# EAGLE design Dazzle_v1 (EAGLE 9.2.1)

## Sheet 1 of 3
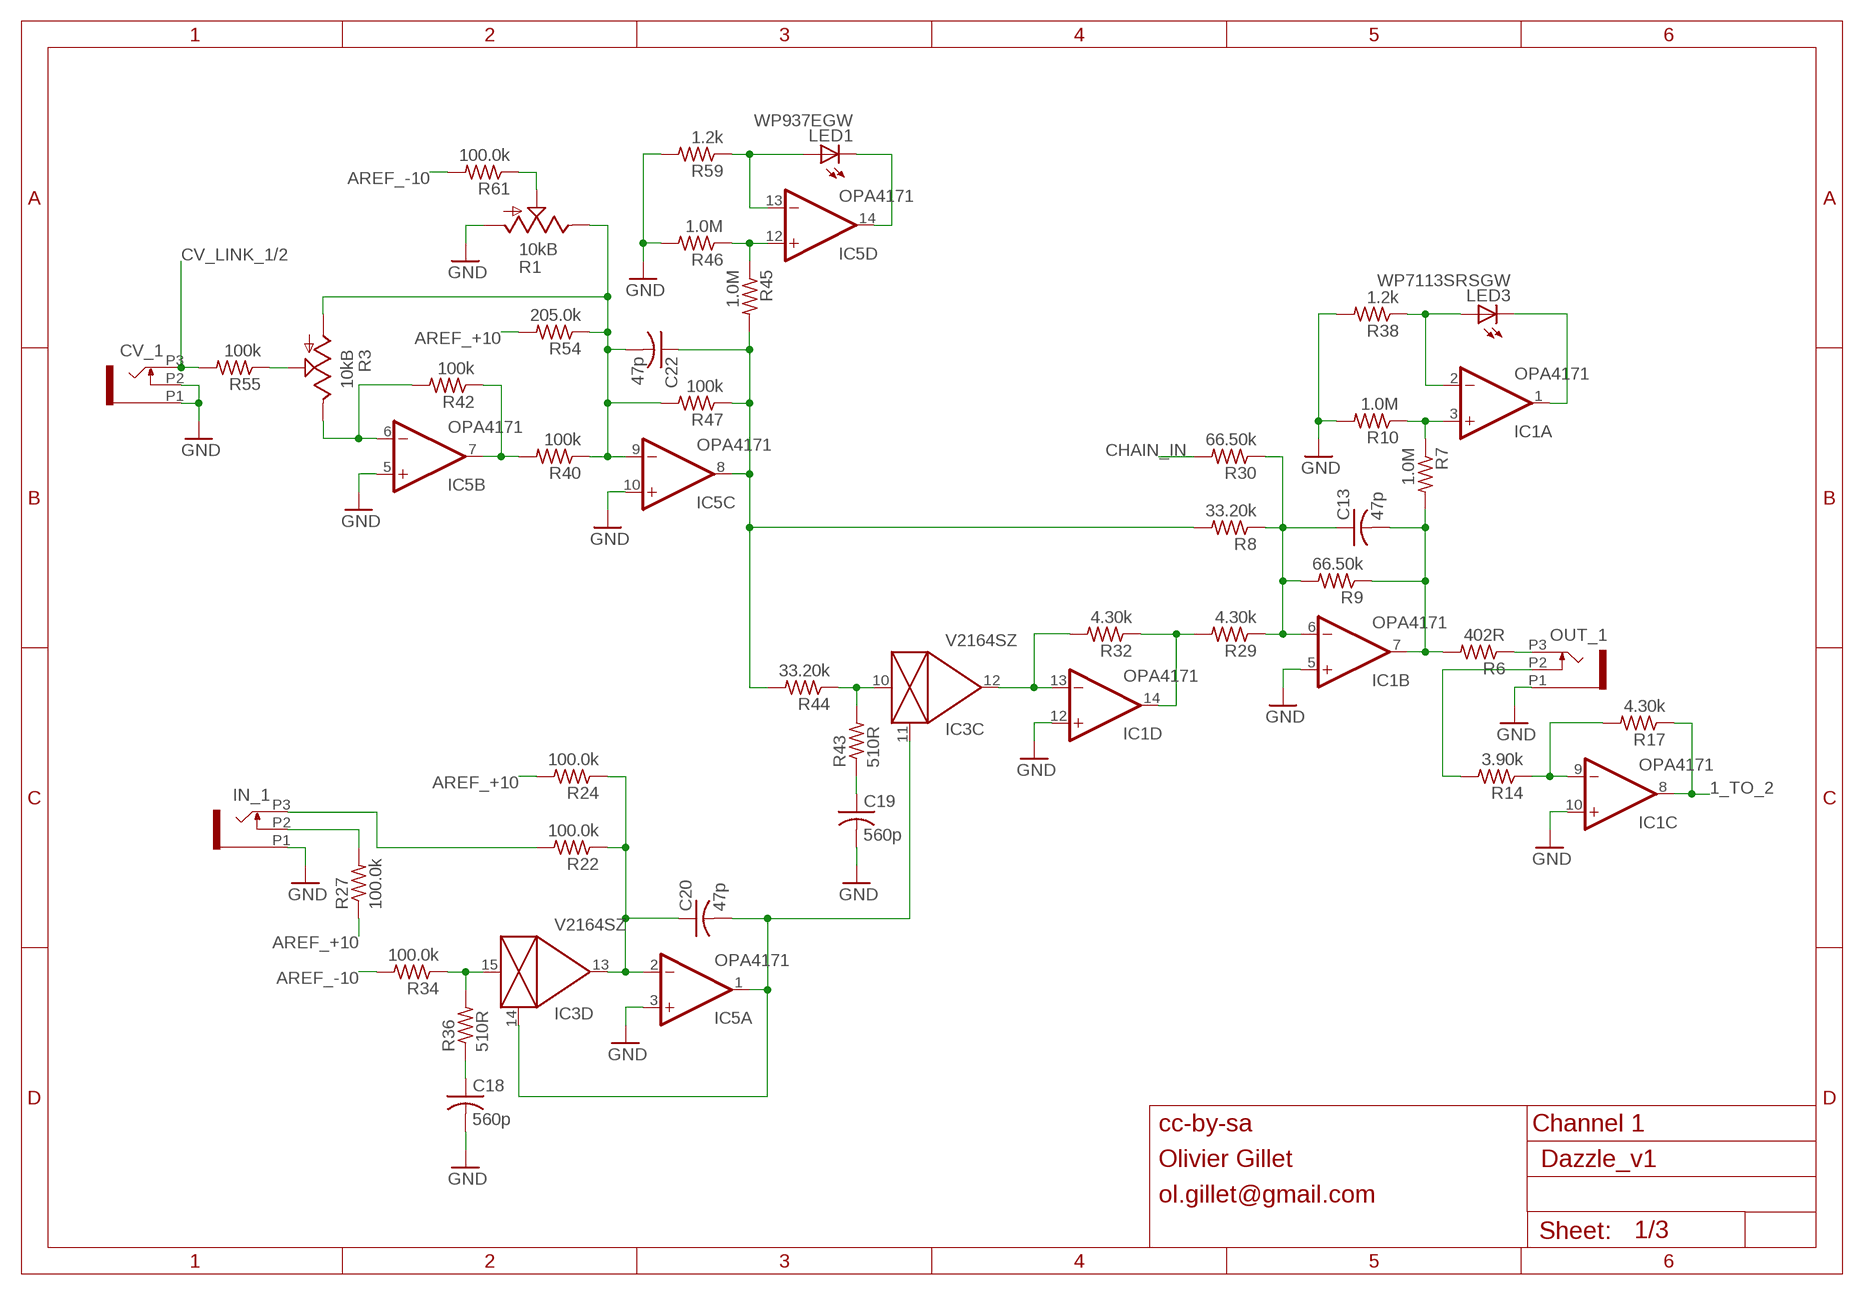
[diagram p0: schematic, sheet 1]

### Parts
C13  47p  C-USC0603  [C0603]
C18  560p  C-USC0603  [C0603]
C19  560p  C-USC0603  [C0603]
C20  47p  C-USC0603  [C0603]
C22  47p  C-USC0603  [C0603]
CV_1  OG-PJ301_PJ301_THONKICONN  [OG-PJ301_WQP_PJ_301M6_NO_HOLE]
IC1  OPA4171  TL074PW  [TSSOP14]
IC3  V2164SZ  SSM2164S  [SOIC16N]
IC5  OPA4171  TL074PW  [TSSOP14]
IN_1  OG-PJ301_PJ301_THONKICONN  [OG-PJ301_WQP_PJ_301M6_NO_HOLE]
LED1  WP937EGW  LED3MM  [LED3MM]
LED3  WP7113SRSGW  LED5MM  [LED5MM]
OUT_1  OG-PJ301_PJ301_THONKICONN  [OG-PJ301_WQP_PJ_301M6_NO_HOLE]
R1  10kB  POT_USVERTICAL_PS  [ALPS_POT_VERTICAL_PS]
R3  10kB  POT-ALPS_POT_USVERTICAL_PS  [POT-ALPS_ALPS_POT_VERTICAL_PS]
R6  402R  R-US_R0603  [R0603]
R7  1.0M  R-US_R0603  [R0603]
R8  33.20k  R-US_R0603  [R0603]
R9  66.50k  R-US_R0603  [R0603]
R10  1.0M  R-US_R0603  [R0603]
R14  3.90k  R-US_R0603  [R0603]
R17  4.30k  R-US_R0603  [R0603]
R22  100.0k  R-US_R0603  [R0603]
R24  100.0k  R-US_R0603  [R0603]
R27  100.0k  R-US_R0603  [R0603]
R29  4.30k  R-US_R0603  [R0603]
R30  66.50k  R-US_R0603  [R0603]
R32  4.30k  R-US_R0603  [R0603]
R34  100.0k  R-US_R0603  [R0603]
R36  510R  R-US_R0603  [R0603]
R38  1.2k  R-US_R0603  [R0603]
R40  100k  R-US_R0603  [R0603]
R42  100k  R-US_R0603  [R0603]
R43  510R  R-US_R0603  [R0603]
R44  33.20k  R-US_R0603  [R0603]
R45  1.0M  R-US_R0603  [R0603]
R46  1.0M  R-US_R0603  [R0603]
R47  100k  R-US_R0603  [R0603]
R54  205.0k  R-US_R0603  [R0603]
R55  100k  R-US_R0603  [R0603]
R59  1.2k  R-US_R0603  [R0603]
R61  100.0k  R-US_R0603  [R0603]

### Nets
1_TO_2: IC1.8(C:OUT) R17.1 ; also sheet 2
AREF_+10: R24.2 R27.1 R54.2 ; also sheet 2,3
AREF_-10: R34.2 R61.2 ; also sheet 2,3
CHAIN_IN: R30.2 ; also sheet 2
CV_LINK_1/2: CV_1.P3 R55.2 ; also sheet 2
FOO: IC3.15(D:IN) R34.1 R36.2
GAIN_1: C22.1 IC5.8(C:OUT) R8.2 R44.2 R45.2 R47.1
GND: C18.2 C19.2 CV_1.P1 CV_1.P2 IC1.5(B:+IN) IC1.10(C:+IN) IC1.12(D:+IN) IC5.3(A:+IN) IC5.5(B:+IN) IC5.10(C:+IN) IN_1.P1 OUT_1.P1 R1.P$3(A) R10.2 R38.2 R46.2 R59.2 ; also sheet 2,3
N$2: R1.P$2(S) R61.1
N$3: IC1.13(D:-IN) IC3.12(C:OUT) R32.2
N$4: IC5.14(D:OUT) LED1.K(C)
N$5: IC5.6(B:-IN) R3.P$1(E) R42.2
N$7: OUT_1.P3 R6.1
N$8: IC5.7(B:OUT) R40.2 R42.1
N$9: C22.2 IC5.9(C:-IN) R1.P$1(E) R3.P$3(A) R40.1 R47.2 R54.1
N$10: C13.1 IC1.6(B:-IN) R8.1 R9.2 R29.1 R30.1
N$14: R3.P$2(S) R55.1
N$15: IC5.13(D:-IN) LED1.A R59.1
N$18: IC1.1(A:OUT) LED3.K(C)
N$19: IC1.2(A:-IN) LED3.A R38.1
N$20: C18.1 R36.1
N$21: IN_1.P3 R22.2
N$22: IC1.9(C:-IN) R14.1 R17.2
N$25: OUT_1.P2 R14.2
N$47: C19.1 R43.1
N$54: IN_1.P2 R27.2
N$64: IC1.14(D:OUT) R29.2 R32.1
N$65: C20.1 IC3.13(D:OUT) IC5.2(A:-IN) R22.1 R24.1
N$66: C20.2 IC3.11(C:CTRL) IC3.14(D:CTRL) IC5.1(A:OUT)
N$75: IC3.10(C:IN) R43.2 R44.1
N$96: IC1.3(A:+IN) R7.1 R10.1
N$99: IC5.12(D:+IN) R45.1 R46.1
OUT1: C13.2 IC1.7(B:OUT) R6.2 R7.2 R9.1

### Notes on the sheet
- cc-by-sa | Channel 1
- Olivier Gillet
- ol.gillet@gmail.com

## Sheet 2 of 3
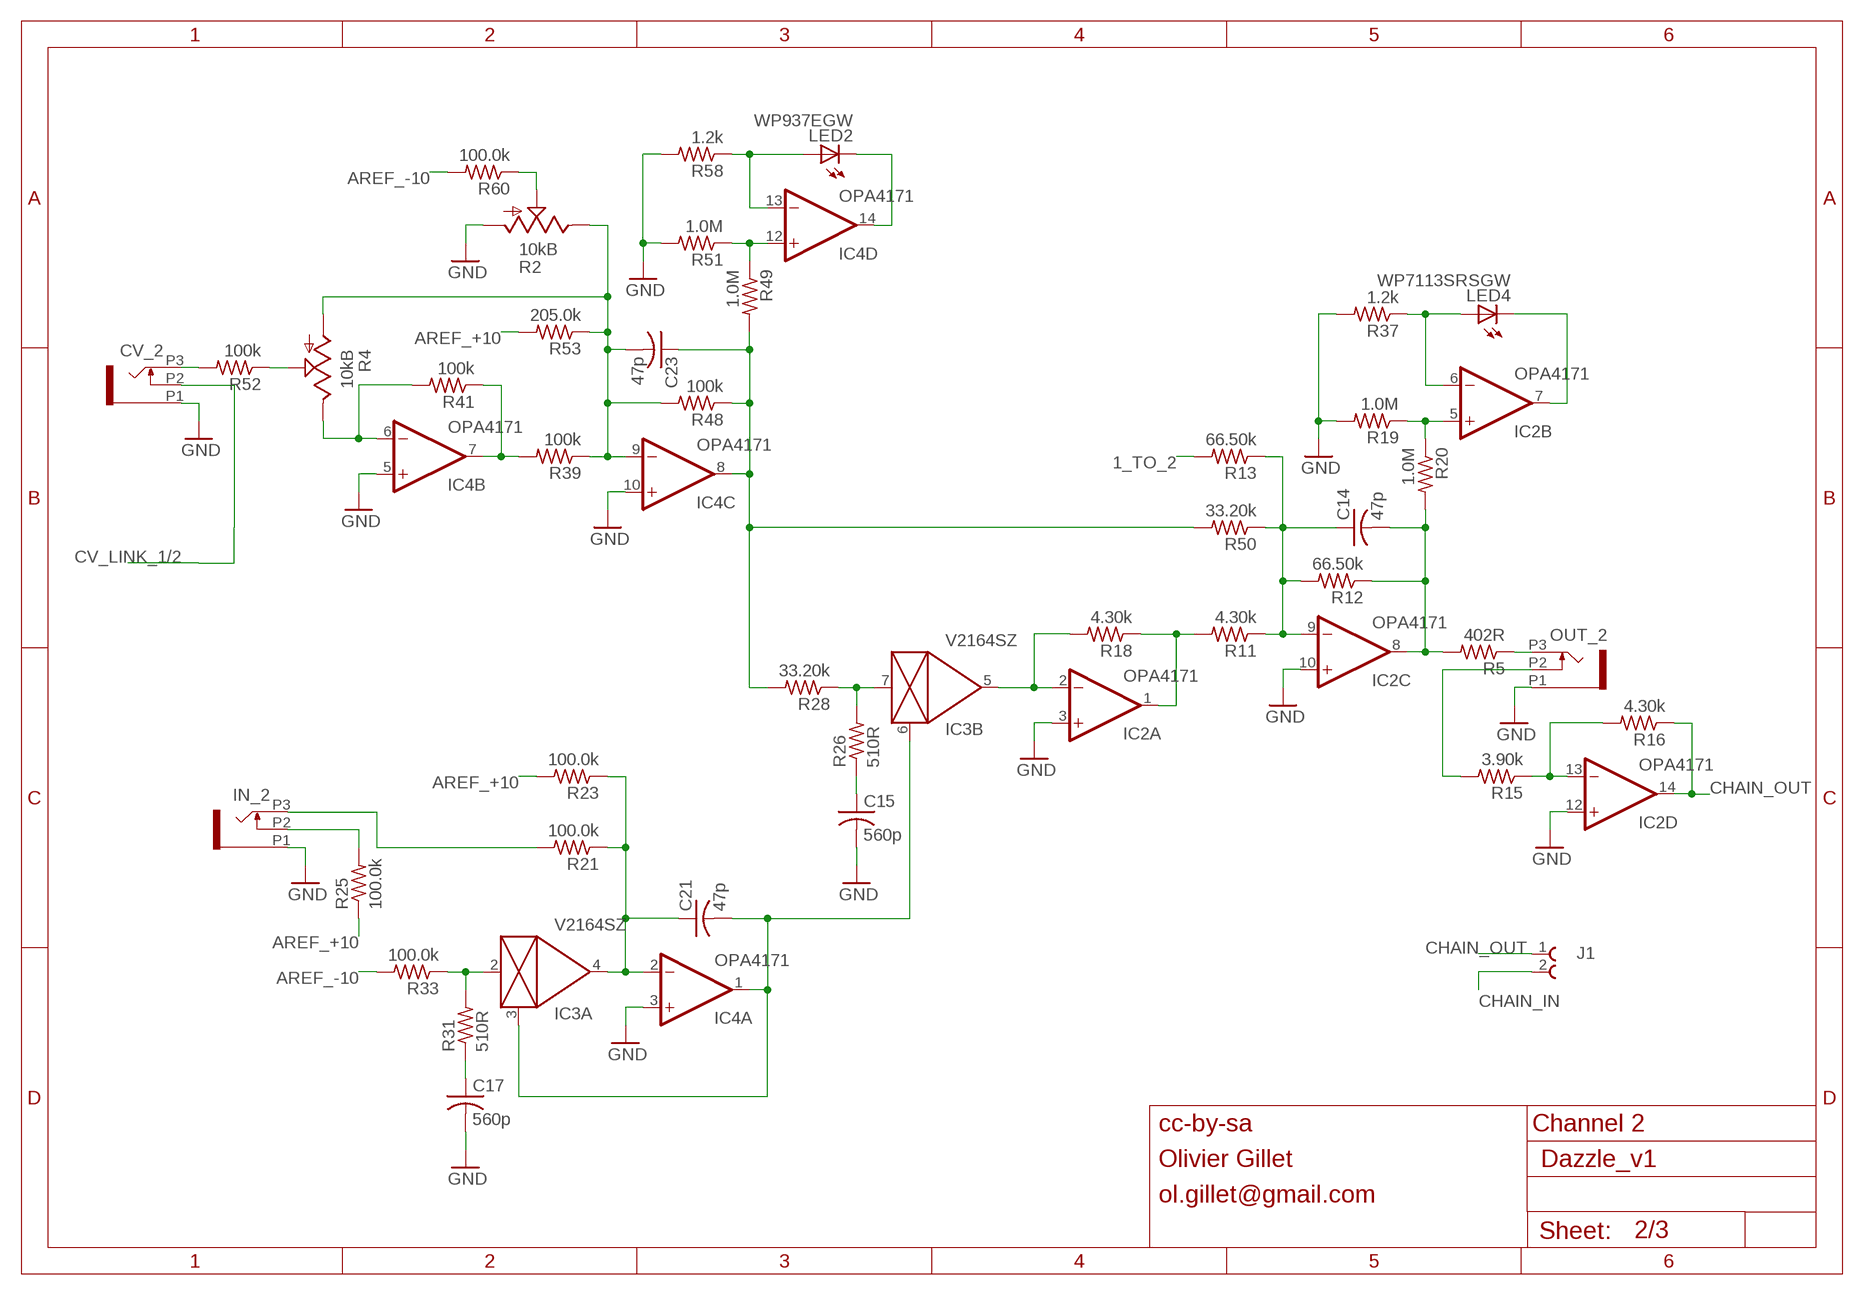
[diagram p1: schematic, sheet 2]

### Parts
C14  47p  C-USC0603  [C0603]
C15  560p  C-USC0603  [C0603]
C17  560p  C-USC0603  [C0603]
C21  47p  C-USC0603  [C0603]
C23  47p  C-USC0603  [C0603]
CV_2  OG-PJ301_PJ301_THONKICONN  [OG-PJ301_WQP_PJ_301M6_NO_HOLE]
IC2  OPA4171  TL074PW  [TSSOP14]
IC4  OPA4171  TL074PW  [TSSOP14]
IN_2  OG-PJ301_PJ301_THONKICONN  [OG-PJ301_WQP_PJ_301M6_NO_HOLE]
J1  61300211121  [61300211121]
LED2  WP937EGW  LED3MM  [LED3MM]
LED4  WP7113SRSGW  LED5MM  [LED5MM]
OUT_2  OG-PJ301_PJ301_THONKICONN  [OG-PJ301_WQP_PJ_301M6_NO_HOLE]
R2  10kB  POT_USVERTICAL_PS  [ALPS_POT_VERTICAL_PS]
R4  10kB  POT-ALPS_POT_USVERTICAL_PS  [POT-ALPS_ALPS_POT_VERTICAL_PS]
R5  402R  R-US_R0603  [R0603]
R11  4.30k  R-US_R0603  [R0603]
R12  66.50k  R-US_R0603  [R0603]
R13  66.50k  R-US_R0603  [R0603]
R15  3.90k  R-US_R0603  [R0603]
R16  4.30k  R-US_R0603  [R0603]
R18  4.30k  R-US_R0603  [R0603]
R19  1.0M  R-US_R0603  [R0603]
R20  1.0M  R-US_R0603  [R0603]
R21  100.0k  R-US_R0603  [R0603]
R23  100.0k  R-US_R0603  [R0603]
R25  100.0k  R-US_R0603  [R0603]
R26  510R  R-US_R0603  [R0603]
R28  33.20k  R-US_R0603  [R0603]
R31  510R  R-US_R0603  [R0603]
R33  100.0k  R-US_R0603  [R0603]
R37  1.2k  R-US_R0603  [R0603]
R39  100k  R-US_R0603  [R0603]
R41  100k  R-US_R0603  [R0603]
R48  100k  R-US_R0603  [R0603]
R49  1.0M  R-US_R0603  [R0603]
R50  33.20k  R-US_R0603  [R0603]
R51  1.0M  R-US_R0603  [R0603]
R52  100k  R-US_R0603  [R0603]
R53  205.0k  R-US_R0603  [R0603]
R58  1.2k  R-US_R0603  [R0603]
R60  100.0k  R-US_R0603  [R0603]

### Nets
1_TO_2: R13.2 ; also sheet 1
AREF_+10: R23.2 R25.1 R53.2 ; also sheet 1,3
AREF_-10: R33.2 R60.2 ; also sheet 1,3
CHAIN_IN: J1.2 ; also sheet 1
CHAIN_OUT: IC2.14(D:OUT) J1.1 R16.1
CV_LINK_1/2: CV_2.P2 ; also sheet 1
FOO1: IC3.2(A:IN) R31.2 R33.1
GAIN_2: C23.1 IC4.8(C:OUT) R28.2 R48.1 R49.2 R50.2
GND: C15.2 C17.2 CV_2.P1 IC2.3(A:+IN) IC2.10(C:+IN) IC2.12(D:+IN) IC4.3(A:+IN) IC4.5(B:+IN) IC4.10(C:+IN) IN_2.P1 OUT_2.P1 R2.P$3(A) R19.2 R37.2 R51.2 R58.2 ; also sheet 1,3
N$6: OUT_2.P3 R5.1
N$17: C15.1 R26.1
N$24: IC3.7(B:IN) R26.2 R28.1
N$26: IC2.2(A:-IN) IC3.5(B:OUT) R18.2
N$27: C14.1 IC2.9(C:-IN) R11.1 R12.2 R13.1 R50.1
N$28: CV_2.P3 R52.2
N$29: IC4.6(B:-IN) R4.P$1(E) R41.2
N$30: IC4.7(B:OUT) R39.2 R41.1
N$31: C23.2 IC4.9(C:-IN) R2.P$1(E) R4.P$3(A) R39.1 R48.2 R53.1
N$32: R2.P$2(S) R60.1
N$33: IC4.14(D:OUT) LED2.K(C)
N$34: IC4.13(D:-IN) LED2.A R58.1
N$35: IC2.7(B:OUT) LED4.K(C)
N$36: IC2.6(B:-IN) LED4.A R37.1
N$37: IC2.13(D:-IN) R15.1 R16.2
N$38: OUT_2.P2 R15.2
N$39: IC2.1(A:OUT) R11.2 R18.1
N$40: R4.P$2(S) R52.1
N$41: C17.1 R31.1
N$42: C21.1 IC3.4(A:OUT) IC4.2(A:-IN) R21.1 R23.1
N$43: C21.2 IC3.3(A:CTRL) IC3.6(B:CTRL) IC4.1(A:OUT)
N$44: IN_2.P3 R21.2
N$87: IN_2.P2 R25.2
N$97: IC2.5(B:+IN) R19.1 R20.1
N$103: IC4.12(D:+IN) R49.1 R51.1
OUT2: C14.2 IC2.8(C:OUT) R5.2 R12.1 R20.2

### Notes on the sheet
- cc-by-sa | Channel 2
- Olivier Gillet
- ol.gillet@gmail.com

## Sheet 3 of 3
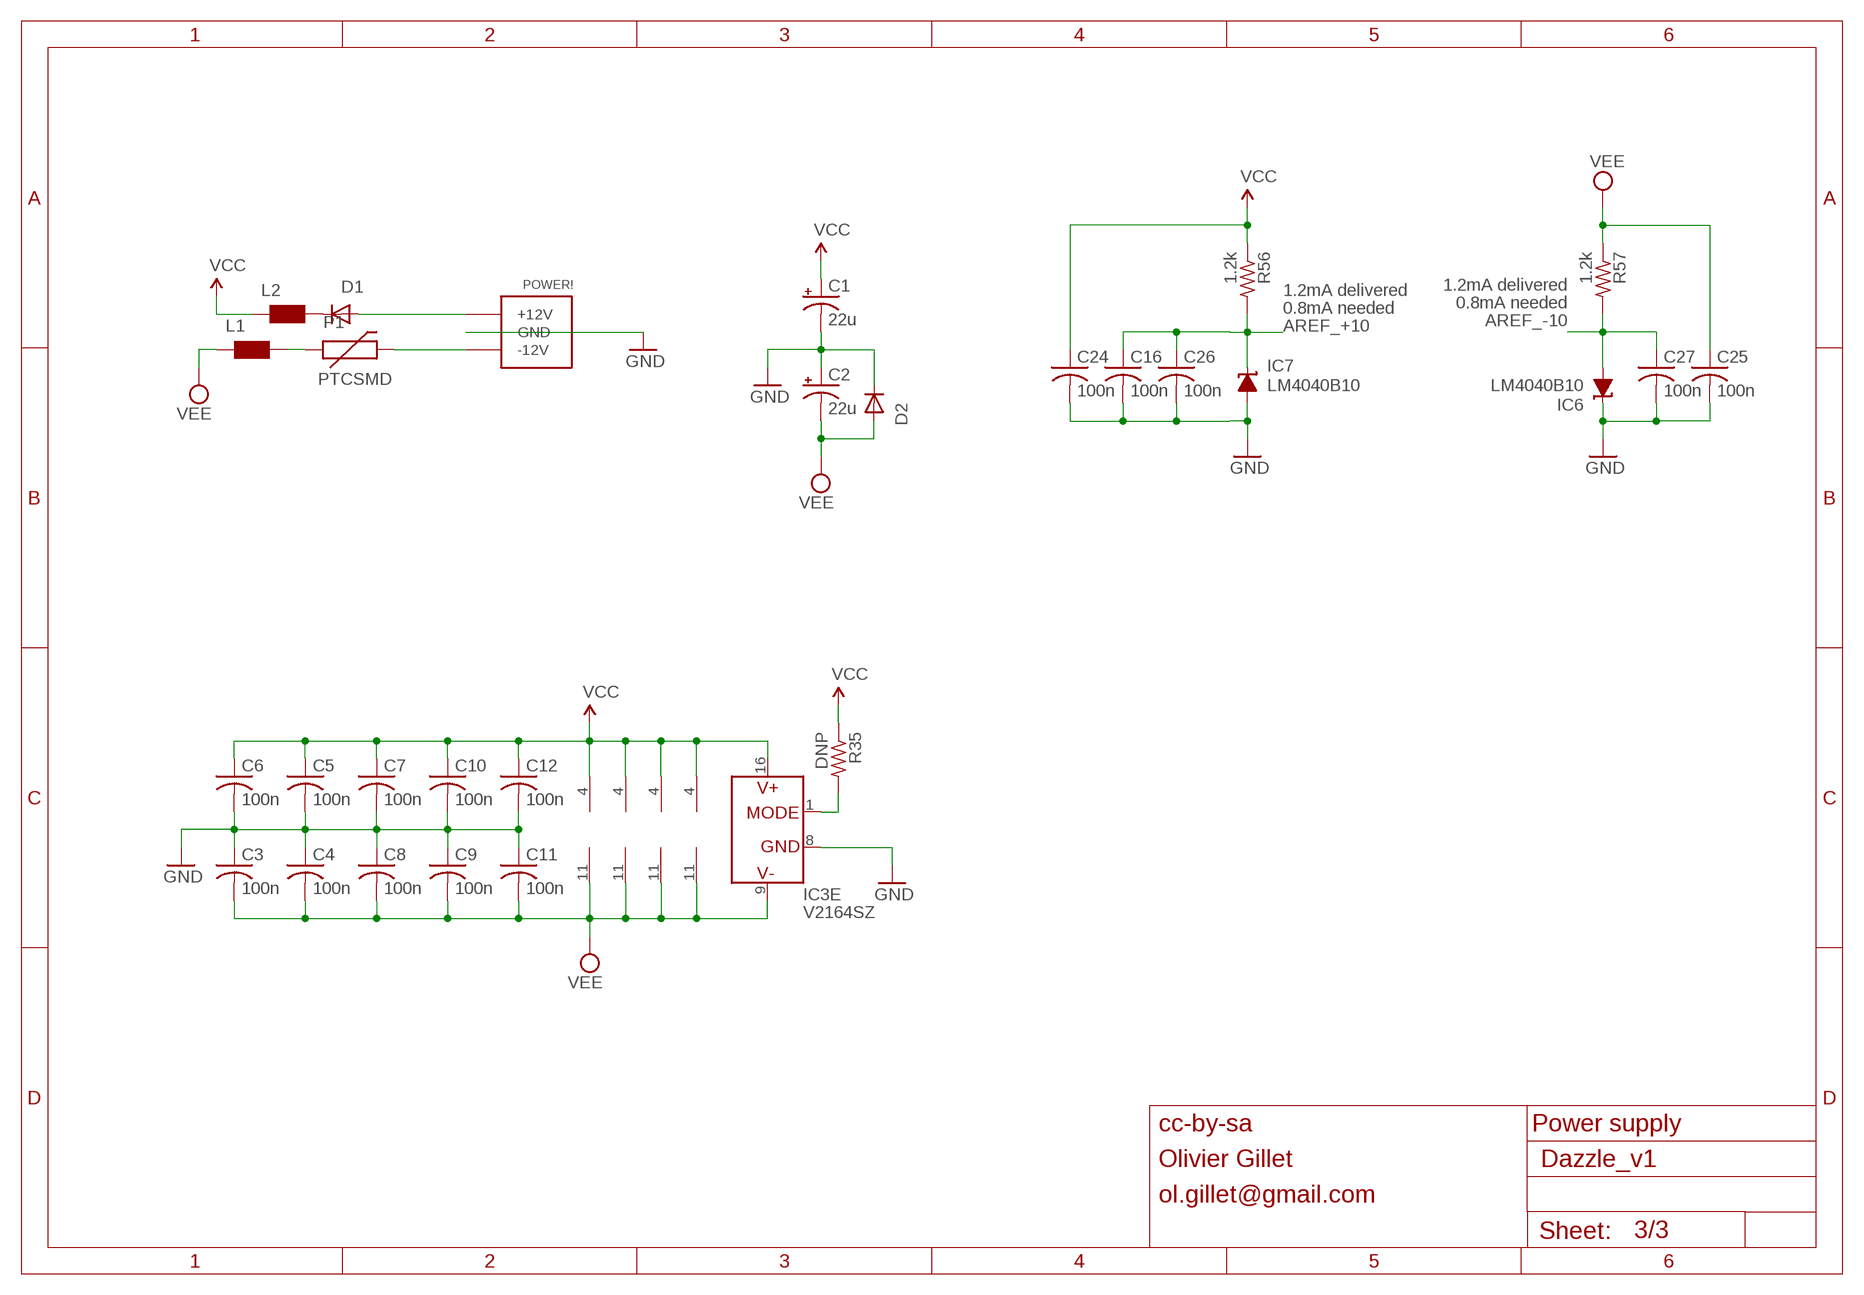
[diagram p2: schematic, sheet 3]

### Parts
C1  22u  CPOL-USC  [PANASONIC_C]
C2  22u  CPOL-USC  [PANASONIC_C]
C3  100n  C-USC0603  [C0603]
C4  100n  C-USC0603  [C0603]
C5  100n  C-USC0603  [C0603]
C6  100n  C-USC0603  [C0603]
C7  100n  C-USC0603  [C0603]
C8  100n  C-USC0603  [C0603]
C9  100n  C-USC0603  [C0603]
C10  100n  C-USC0603  [C0603]
C11  100n  C-USC0603  [C0603]
C12  100n  C-USC0603  [C0603]
C16  100n  C-USC0603  [C0603]
C24  100n  C-USC0603  [C0603]
C25  100n  C-USC0603  [C0603]
C26  100n  C-USC0603  [C0603]
C27  100n  C-USC0603  [C0603]
D1  1N5819HW  DIODE-SOD123  [SOD123]
D2  1N5819HW  DIODE-SOD123  [SOD123]
IC6  LM4040B10  LM4041B12DBZ  [DBZ_R-PDSO-G3]
IC7  LM4040B10  LM4041B12DBZ  [DBZ_R-PDSO-G3]
L1  WE-CBF_0603  [0603]
L2  WE-CBF_0603  [0603]
P1  PTCSMD  [PTC-1206]
POWER!  POWER_SIMPLE  [2X05_SMT_HEADER]
R35  DNP  R-US_R0603  [R0603]
R56  1.2k  R-US_R0603  [R0603]
R57  1.2k  R-US_R0603  [R0603]

### Nets
AREF_+10: C16.1 C26.1 IC7.1(C) R56.2 ; also sheet 1,2
AREF_-10: C27.1 IC6.2(A) R57.2 ; also sheet 1,2
GND: C1.- C2.+ C3.1 C4.1 C5.2 C6.2 C7.2 C8.1 C9.1 C10.2 C11.1 C12.2 C16.2 C24.2 C25.2 C26.2 C27.2 D2.C IC3.8(E:GND) IC6.1(C) IC7.2(A) POWER!.3(GND) POWER!.4(GND) POWER!.5(GND) POWER!.6(GND) POWER!.7(GND) POWER!.8(GND) ; also sheet 1,2
N$1: IC3.1(E:MODE) R35.2
N$11: D1.A POWER!.9(+12V) POWER!.10(+12V)
N$12: P1.2 POWER!.1(-12V) POWER!.2(-12V)
N$13: L1.2 P1.1
N$16: D1.C L2.2
VCC: C1.+ C5.1 C6.1 C7.1 C10.1 C12.1 C24.1 IC1.4(P:V+) IC2.4(P:V+) IC3.16(E:V+) IC4.4(P:V+) IC5.4(P:V+) L2.1 R35.1 R56.1
VEE: C2.- C3.2 C4.2 C8.2 C9.2 C11.2 C25.1 D2.A IC1.11(P:V-) IC2.11(P:V-) IC3.9(E:V-) IC4.11(P:V-) IC5.11(P:V-) L1.1 R57.1

### Notes on the sheet
- 1.2mA delivered
- 1.2mA delivered | 0.8mA needed
- 0.8mA needed
- cc-by-sa | Power supply
- Olivier Gillet
- ol.gillet@gmail.com

## Library data of the parts
C1 C2 = rcl:CPOL-US: POLARIZED CAPACITOR, American symbol
C3-C27 = rcl:C-US: CAPACITOR, American symbol
CV_1 CV_2 IN_1 IN_2 OUT_1 OUT_2 = SHAY_THONKICONNS:OG-PJ301_PJ301_THONKICONN
D1 D2 = diode:DIODE-: DIODE
IC1 IC2 IC4 IC5 = linear:TL074: OP AMP
IC3 = ssm2164:SSM2164
IC6 IC7 = texas:LM4041: PRECISION MICROPOWER SHUNT VOLTAGE REFERENCE Source: http://focus.ti.com/lit/ds/slcs146e/slcs146e.pdf
J1 = Wurth_Elektronik_Electromechanic_Board_to_Board_Connectors_rev17a:61300211121: WR-PHD 2.54mm Pin Header, 2 Pin=>Code : Con_BTB_PHD_2.54_1_THT_61300211121 <http://katalog.we-online.de/media/images/eican/Con_BTB_PHD_2.54_1_THT_6130xx11121_pf2.jpg> Details see: http://katalog.we-online.de/en/em/613_0xx_111_21 Created 2014-05-29, Karrer Zheng 2014 (C) Würth Elektronik
L1 L2 = wuerth-elektronik:WE-CBF: SMD EMI Suppression Ferrite Beads - excellent anti-EMI properties - low DCR - impedances till 3000 ohms - rated current up to 6 A
LED1-LED4 = led:LED: LED OSRAM: - CHIPLED LG R971, LG N971, LY N971, LG Q971, LY Q971, LO R971, LY R971 LH N974, LH R974 LS Q976, LO Q976, LY Q976 LO Q996 - Hyper CHIPLED LW Q18S LB Q993, LB Q99A, LB R99A - SideLED LS A670, LO A670, LY A670, LG A670, LP A670 LB A673, LV A673, LT A673, LW A673 LH A674 LY A675 LS A676, LA A676, LO A676, LY A676, LW A676 LS A679, LY A679, LG A679 - Hyper Micro SIDELED® LS Y876, LA Y876, LO Y876, LY Y876 LT Y87S - SmartLED LW L88C, LW L88S LB L89C, LB L89S, LG L890 LS L89K, LO L89K, LY L89K LS L896, LA L896, LO L896, LY L896 - TOPLED LS T670, LO T670, LY T670, LG T670, LP T670 LSG T670, LSP T670, LSY T670, LOP T670, LYG T670 LG T671, LOG T671, LSG T671 LB T673, LV T673, LT T673, LW T673 LH T674 LS T676, LA T676, LO T676, LY T676, LB T676, LH T676, LSB T676, LW T676 LB T67C, LV T67C, LT T67C, LS T67K, LO T67K, LY T67K, LW E67C LS E67B, LA E67B, LO E67B, LY E67B, LB E67C, LV E67C, LT E67C LW T67C LS T679, LY T679, LG T679 LS T770, LO T770, LY T770, LG T770, LP T770 LB T773, LV T773, LT T773, LW T773 LH T774 LS E675, LA E675, LY E675, LS T675 LS T776, LA T776, LO T776, LY T776, LB T776 LHGB T686 LT T68C, LB T68C - Hyper Mini TOPLED® LB M676 - Mini TOPLED Santana® LG M470 LS M47K, LO M47K, LY M47K Source: http://www.osram.convergy.de LUXEON: - LUMILED® LXK2-PW12-R00, LXK2-PW12-S00, LXK2-PW14-U00, LXK2-PW14-V00 LXK2-PM12-R00, LXK2-PM12-S00, LXK2-PM14-U00 LXK2-PE12-Q00, LXK2-PE12-R00, LXK2-PE12-S00, LXK2-PE14-T00, LXK2-PE14-U00 LXK2-PB12-K00, LXK2-PB12-L00, LXK2-PB12-M00, LXK2-PB14-N00, LXK2-PB14-P00, LXK2-PB14-Q00 LXK2-PR12-L00, LXK2-PR12-M00, LXK2-PR14-Q00, LXK2-PR14-R00 LXK2-PD12-Q00, LXK2-PD12-R00, LXK2-PD12-S00 LXK2-PH12-R00, LXK2-PH12-S00 LXK2-PL12-P00, LXK2-PL12-Q00, LXK2-PL12-R00 Source: www.luxeon.com KINGBRIGHT: KA-3528ASYC Source: www.kingbright.com
P1 = SparkFun:PTC: Resettable Fuse PTC Resettable Fuse. Spark Fun Electronics SKU : COM-08357
POWER! = EurorackModularParts:POWER_SIMPLE
R1 R2 = pot-alps:POT_US
R3 R4 = braids_v50:POT-ALPS_POT_US
R5-R61 = rcl:R-US_: RESISTOR, American symbol

## Board
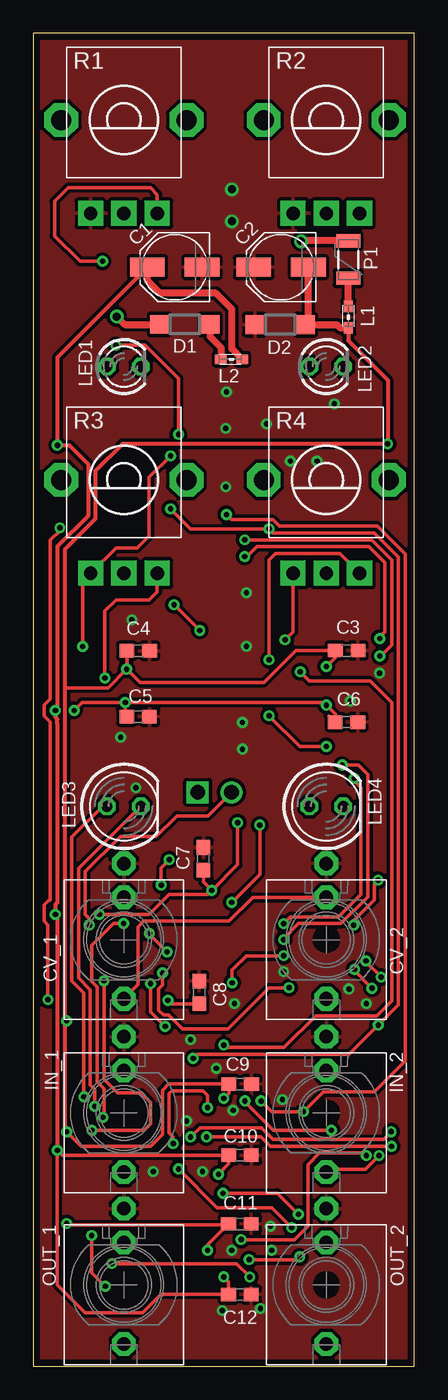
[diagram p3: board, top side]
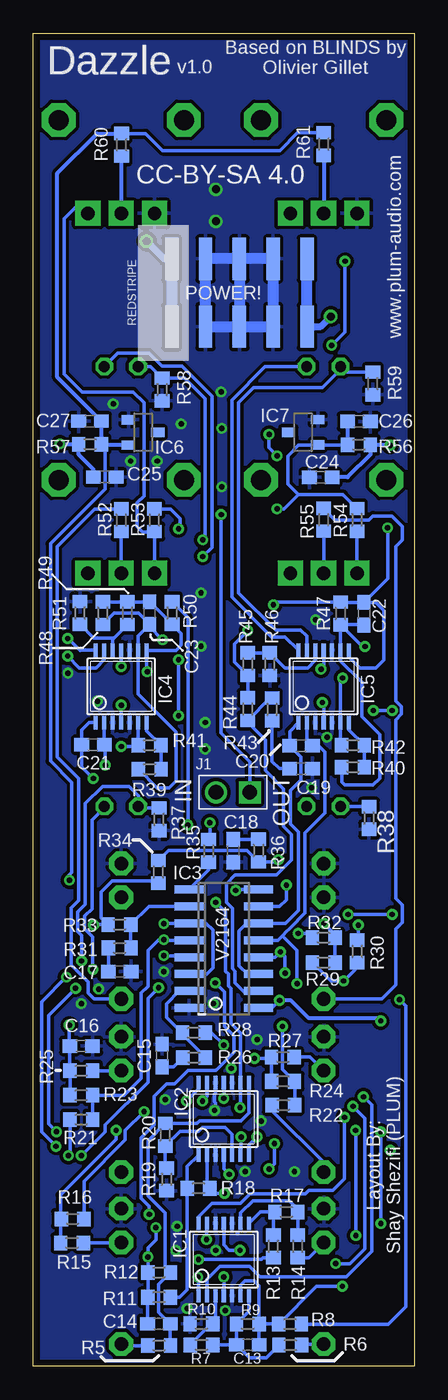
[diagram p4: board, bottom side, seen from below]

Size 28.6 x 100 mm. Coordinates in mm from the lower left corner, seen from the top.
Outline: 0,0 28.6,0 28.6,100 0,100 0,0
Copper layers (1*16): Top 0.035mm / dielectric 1.5mm / Bottom 0.035mm
Design rules "default *": minimum track width 6mil, minimum drill 0.4mm, track to track 10mil, track to pad 6mil, pad to pad 6mil, via to via 6mil, smd to smd 6mil, copper to edge 20mil, drill to drill 6mil, minimum pad ring 10mil, minimum via ring 8mil, stop-mask expansion 4mil, vias tented up to drill 25mil, thermal gap 10mil

### Footprints (pad centres in the part's own frame; a part is rotated, then mirrored left to right if it is on the bottom)
PANASONIC_C = smd 2.6 x 1.4: + 2.05,0; - -2.05,0
C0603 = smd 1.1 x 1: 1 -0.85,0; 2 0.85,0
OG-PJ301_WQP_PJ_301M6_NO_HOLE = drill 1.016 pad 1.778 octagon: P1 0,-5.715; P2 0,-3.175; P3 0,4.445
SOD123 = smd 1.4 x 1.4: A 1.9,0; C -1.9,0
TSSOP14 = smd 0.305 x 0.991: 1 -1.905,-2.718; 2 -1.27,-2.718; 3 -0.635,-2.718; 4 0,-2.718; 5 0.635,-2.718; 6 1.27,-2.718; 7 1.905,-2.718; 8 1.905,2.718; 9 1.27,2.718; 10 0.635,2.718; 11 0,2.718; 12 -0.635,2.718; 13 -1.27,2.718; 14 -1.905,2.718
SOIC16N = smd 0.6 x 2.2: 1 -4.445,-2.6; 2 -3.175,-2.6; 3 -1.905,-2.6; 4 -0.635,-2.6; 5 0.635,-2.6; 6 1.905,-2.6; 7 3.175,-2.6; 8 4.445,-2.6; 9 4.445,2.6; 10 3.175,2.6; 11 1.905,2.6; 12 0.635,2.6; 13 -0.635,2.6; 14 -1.905,2.6; 15 -3.175,2.6; 16 -4.445,2.6
DBZ_R-PDSO-G3 = smd 0.7 x 1: 1 -0.95,-1.1; 2 0.95,-1.1; 3 0,1.1
61300211121 = drill 1.1 square: 1 -1.27,0 | drill 1.1: 2 1.27,0
0603 = smd 0.85 x 0.7: 1 -0.9,0; 2 0.7,0
LED3MM = drill 0.813 octagon: A -1.27,0; K 1.27,0
LED5MM = drill 0.813 octagon: A -1.27,0; K 1.27,0
PTC-1206 = smd 1 x 1.8: 1 -1.4,0; 2 1.4,0
2X05_SMT_HEADER = smd 1 x 3.17: 1 -5.08,-2.54; 2 -5.08,2.54; 3 -2.54,-2.54; 4 -2.54,2.54; 5 0,-2.54; 6 0,2.54; 7 2.54,-2.54; 8 2.54,2.54; 9 5.08,-2.54; 10 5.08,2.54
ALPS_POT_VERTICAL_PS = drill 1 pad 1.88 square: P$1 -2.5,7; P$2 0,7; P$3 2.5,7 | drill 1.5 pad 2.54 octagon: P$4 -4.7,0; P$5 4.7,0
POT-ALPS_ALPS_POT_VERTICAL_PS = drill 1 pad 1.88 square: P$1 -2.5,7; P$2 0,7; P$3 2.5,7 | drill 1.5 pad 2.54 octagon: P$4 -4.7,0; P$5 4.7,0
R0603 = smd 1 x 1.1: 1 -0.85,0; 2 0.85,0

### Placement (x,y rotation side)
C1  10.62,82.45 180 top
C2  18.6,82.45 180 top
C3  23.53,53.69 180 top
C4  7.88,53.67 180 top
C5  7.87,48.73 0 top
C6  23.52,48.32 0 top
C7  12.77,38.07 90 top
C8  12.45,28.05 270 top
C9  15.53,21.17 180 top
C10  15.52,15.83 0 top
C11  15.51,10.68 180 top
C12  15.51,5.38 0 top
C13  12.5,1.61 180 bottom
C14  19.17,3.18 0 bottom
C15  18.93,23.31 90 bottom
C16  25.01,24.02 0 bottom
C17  22.11,29.61 0 bottom
C18  13.6,38.67 270 bottom
C19  8.5,44.83 0 bottom
C20  8.5,46.55 180 bottom
C21  24.12,46.62 180 bottom
C22  3.78,56.46 270 bottom
C23  19.87,56.51 270 bottom
C24  7.02,66.69 180 bottom
C25  23.23,66.71 0 bottom
C26  4.15,70.88 0 bottom
C27  24.35,70.9 180 bottom
CV_1  6.8,32 180 top
CV_2  22,32 180 top
D1  11.37,78.16 180 top
D2  18.53,78.14 0 top
IC1  14.3,8 0 bottom
IC2  14.3,18.55 0 bottom
IC3  14.3,31.32 270 bottom
IC4  22,51 0 bottom
IC5  6.8,51 0 bottom
IC6  20.35,70.06 270 bottom
IC7  8.35,70.07 90 bottom
IN_1  6.8,19 180 top
IN_2  22,19 180 top
J1  13.61,43.06 180 bottom
L1  23.65,78.81 90 top
L2  14.78,75.55 180 top
LED1  6.8,75 0 top
LED2  22,75 0 top
LED3  6.8,42 0 top
LED4  22,42 0 top
OUT_1  6.8,6.1 180 top
OUT_2  22,6.1 180 top
P1  23.65,83.03 90 top
POWER!  13.13,80.54 0 bottom
R1  6.8,93.5 180 top
R2  22,93.5 180 top
R3  6.8,66.5 180 top
R4  22,66.5 180 top
R5  19.15,1.55 0 bottom
R6  9.31,1.58 180 bottom
R7  15.97,1.6 0 bottom
R8  9.32,3.16 0 bottom
R9  12.5,3.17 0 bottom
R10  15.98,3.18 180 bottom
R11  19.16,5.17 0 bottom
R12  19.15,7.03 180 bottom
R13  10.57,8.99 90 bottom
R14  8.75,9 270 bottom
R15  25.7,9.25 0 bottom
R16  25.65,11.05 180 bottom
R17  9.61,11.57 0 bottom
R18  16.2,13.35 0 bottom
R19  18.59,14.02 270 bottom
R20  18.69,17.37 90 bottom
R21  25,18.5 180 bottom
R22  9.82,19.6 180 bottom
R23  24.99,20.33 180 bottom
R24  9.85,21.37 180 bottom
R25  24.99,22.17 0 bottom
R26  16.53,23.16 0 bottom
R27  9.87,23.19 0 bottom
R28  16.55,25.02 0 bottom
R29  6.8,30.28 0 bottom
R30  4.28,31.12 90 bottom
R31  22.11,31.38 0 bottom
R32  6.8,32.15 180 bottom
R33  22.13,33.13 180 bottom
R34  19.21,37.09 270 bottom
R35  15.44,38.67 270 bottom
R36  11.69,38.68 270 bottom
R37  19.16,41.03 270 bottom
R38  3.39,41.13 270 bottom
R39  19.86,44.8 0 bottom
R40  4.6,44.94 0 bottom
R41  19.87,46.59 180 bottom
R42  4.6,46.59 180 bottom
R43  10.67,49.28 90 bottom
R44  12.5,49.3 90 bottom
R45  12.49,52.67 270 bottom
R46  10.84,52.67 270 bottom
R47  5.53,56.48 270 bottom
R48  23.38,56.49 270 bottom
R49  21.53,56.5 90 bottom
R50  18.18,56.51 270 bottom
R51  25.09,56.52 90 bottom
R52  21.99,63.47 90 bottom
R53  19.51,63.47 90 bottom
R54  4.3,63.5 90 bottom
R55  6.8,63.51 90 bottom
R56  4.14,69.13 180 bottom
R57  24.34,69.17 0 bottom
R58  18.93,73.28 270 bottom
R59  3.11,73.73 270 bottom
R60  21.97,91.63 90 bottom
R61  6.79,91.69 90 bottom

### Tracks (layer width: path | path; a pad name or v marks a point on that pad's centre or on a via)
1_TO_2
  Bottom 0.254: IC1.8 11.54,11.57 R17.1 10.57,11.46 R13.2
AREF_+10  (via drill 0.4)
  Top 0.254: v12,23.1 12.3,23.4 23.1,23.4 23.7,23.4 v25.9,25.6 27.41,27.11 27.41,60.71 25.61,62.51 18.01,62.51 v17.7,62.82 11.8,62.82 v10.3,64.32
  Bottom 0.254: R54.2 5.35,65.4 8.7,65.4 | 8.7,65.4 9.5,66.2 9.5,68.3 8.68,69.12 IC7.1 | v10.3,64.32 9.78,64.32 8.7,65.4 | 25.84,25.54 v25.9,25.6 25.9,24.06 C16.1 25.86,22.19 | R25.1 25.86,22.19 | v12,23.1 10.81,23.1 R27.1 10.72,21.39 R24.2 | R25.1 R23.2 | 25.86,22.19 R25.1 | R53.2 19.49,64.3 18.3,64.3 17.6,63.6 17.6,62.92 v17.7,62.82
  Bottom 0.305: IC7.1 R56.2 C26.1
AREF_-10  (via drill 0.4)
  Top 0.254: v24.06,33.1 24.06,33.44 25.61,34.99 25.61,36.18 v25.89,36.46
  Bottom 0.254: v24.06,33.1 24.03,33.13 R33.2 23.5,33.65 23.5,35.6 22.7,36.4 19.37,36.4 R34.2 | v25.89,36.46 25.89,36.87 25.71,37.06 25.71,43.8 27.31,45.4 27.31,61.71 23.21,65.81 23.21,68.89 23.43,69.11 | R61.2 8.76,92.54 10.1,91.2 18.9,91.2 20.18,92.48 R60.2
  Bottom 0.305: IC6.2 23.43,69.11 R57.2 C27.1 26.8,74.2 26.8,89.5 23.82,92.48 R60.2
CHAIN_IN  (via drill 0.4)
  Top 0.254: v4.2,33.1 4.2,33.6 3.91,33.89 3.91,37.12 6.54,39.75 9.23,39.75 10.78,41.3 13.12,41.3 J1.2
  Bottom 0.254: R30.2 4.2,32.05 v4.2,33.1
CHAIN_OUT  (via drill 0.4)
  Top 0.254: v17.1,19.9 17.9,19.1 v20.28,19.1 21.78,20.6 25.6,20.6 27.92,22.92 27.92,27.6 | 25.82,63.02 25.8,63.02 | 25.82,63.02 25.8,63.02 | 27.92,26.9 27.92,27.6 | 27.92,27.6 27.92,60.92 25.82,63.02 | v14.5,63.9 14.9,63.5 17.98,63.5 18.47,63.02 25.8,63.02
  Bottom 0.254: IC2.14 16.2,20.8 v17.1,19.9 | R16.1 24.8,13.88 21.7,16.98 21.7,17.68 v20.28,19.1 | J1.1 12.34,45.34 14.5,47.5 v14.5,63.9
CV_LINK_1/2
  Top 0.254: CV_2.P2 16.48,35.17 14.69,33.39 8.29,33.39 7.87,32.97 7.87,28.63 CV_1.P3
  Bottom 0.254: R55.2 5.94,63.5 3.4,63.5 3.1,63.8 1.7,63.8 0.9,63 0.9,62 1.4,61.5 1.4,49.91 0.97,49.48 0.97,48.92 1.4,48.48 1.4,35.1 0.9,34.6 0.9,33.3 1.4,32.8 1.4,28.6 2.44,27.55 CV_1.P3
FOO  (via drill 0.4)
  Top 0.254: v10.2,38 9.6,37.4 v9.6,36.1
  Bottom 0.254: R34.1 18.46,38.69 12.55,38.69 R36.2 10.37,37.83 v10.2,38 | v9.6,36.1 9.6,35 10.11,34.49 IC3.15
FOO1
  Bottom 0.254: IC3.2 19.91,34.49 R33.1 21.28,31.4 R31.2
GAIN_1  (via drill 0.4)
  Top 0.254: v12.5,55.2 v10.57,57.13 | v1.09,27.5 1.09,33.11 0.8,33.4 0.8,34.6 1.2,35 1.27,35 1.27,48.33 0.8,48.8 0.8,49.6 1.27,50.07 | 1.27,50.07 1.27,50.1 | 1.27,50.07 1.27,61.97 2,62.7 v2,62.9
  Bottom 0.254: 2.3,55.5 2.3,55.2 | C22.1 2.9,57.31 2.3,56.71 2.3,55.5 | C22.1 5.51,57.31 R47.1 10.37,57.33 v10.57,57.13 | IC5.8 4.89,53.2 4.1,52.4 2.9,52.4 2.3,53 2.3,55.5 | R44.2 R45.2 13.5,52.83 13.5,54.2 v12.5,55.2 | R8.2 1.94,3.16 0.64,4.46 0.64,27.04 v1.09,27.5 | C22.1 2,59.09 v2,62.9
GAIN_2  (via drill 0.4)
  Top 0.254: v20.05,52.1 20.75,51.4 25.3,51.4 26.6,50.1 26.9,49.8 26.9,35.86 26.9,29.8 26.9,27.4 25.8,26.3 21.2,26.3 18.81,23.91 14.49,23.91 v14.3,24.1
  Bottom 0.254: R48.1 R49.2 C23.1 R50.2 17.5,54.98 17.5,54.1 17.9,53.7 20.08,53.7 IC4.8 20.09,52.15 v20.05,52.1 | v14.3,24.1 15.22,25.02 R28.2
GND  (via drill 0.4, 0.6)
  Bottom 0.254: 13.3,9.94 13.24,9.94 | IC1.10 13.66,10.31 | 15.1,19.3 14.94,19.46 14.94,19.77 14.98,19.82 14.98,20.38 14.94,20.43 IC2.12
  Bottom 0.813: POWER!.6 POWER!.8 POWER!.7 POWER!.5 | POWER!.6 POWER!.4 POWER!.3 POWER!.5 | POWER!.6 POWER!.5
  other vias: 14.18,4.18 17.05,4.33 15.1,27.2 18.8,29.6 17.8,10.5 17.9,8.7 14.9,8.7 23.7,28.3 21.3,67.9 19.3,67.9 17.5,70.7 23.8,49.9 7.4,56 13.73,22.35 6.55,47.18 7.7,43.4 25,27.2 11.8,24.5 26,52 18.7,20 12.7,14.6 9,14.6 14.5,73.1 14.45,70.37 14.45,65.98 16.01,58.02 16.01,54.02 15.7,48.3 15.7,46.3 11.5,18.4 15,19.2 14.9,88.3 14.9,85.9 22.6,72.2
  pour Top: 28.6,100.1 -0.2,100.1 -0.2,96 -0.2,-0.3 -0.1,-0.3 28.9,-0.3 28.9,5.1 28.9,100.1 28.7,100.1
  pour Bottom: 28.6,100.1 -0.2,100.1 -0.2,96 -0.2,-0.3 -0.1,-0.3 28.9,-0.3 28.9,5.1 28.9,100.1 28.7,100.1
KO
  cutout Top: 22,7.1 arc90 21,6.1 arc90 22,5.1 arc90 23,6.1 arc90
  cutout Top: 6.8,5.1 arc90 7.8,6.1 arc90 6.8,7.1 arc90 5.8,6.1 arc90
  cutout Top: 22,20 arc-90 23,19 arc-90 22,18 arc-90 21,19 arc-90
  cutout Top: 22,33 arc-90 23,32 arc-90 22,31 arc-90 21,32 arc-90
  cutout Top: 6.8,33 arc-90 7.8,32 arc-90 6.8,31 arc-90 5.8,32 arc-90
  cutout Top: 6.8,18 arc90 7.8,19 arc90 6.8,20 arc90 5.8,19 arc90
N$1
  Bottom 0.254: R35.2 15.44,37.23 IC3.1
N$2
  Bottom 0.305: R61.1 R1.P$2
N$3  (via drill 0.4)
  Top 0.254: v10.05,31.08 8.71,32.42 v8.71,32.47 | v25,15.8 24.81,15.99 21.49,15.99 20.6,15.1 20.6,10.5 19.6,9.5 v15.6,9.5 | v9.7,29.5 9.7,28.6 9.41,28.31 9.41,26.71 9.77,26.35 10.15,26.35 11.2,25.3 14.6,25.3 17.7,28.4 v19.2,28.4
  Bottom 0.254: IC3.12 11.5,30.68 | 11.5,30.68 10.45,30.68 v10.05,31.08 9.7,30.73 v9.7,29.5 | v8.71,32.47 7.97,32.47 R32.2 | IC1.13 15.6,10.69 v15.6,9.5 | 11.63,30.55 11.5,30.68 | v25,15.8 23.2,17.6 23.2,18.1 19.99,21.31 19.99,27.61 v19.2,28.4
N$4
  Bottom 0.254: IC5.14 9.71,54.72 10.72,54.72 13.7,57.7 13.7,72.5 11.2,75 LED1.K
N$5  (via drill 0.4)
  Top 0.254: 5.3,51.6 5.4,51.6 v5.37,51.63 5.37,56.67 6.2,57.5 8.7,57.5 9.3,58.1 R3.P$1
  Bottom 0.254: R42.2 5.53,46.67 IC5.6 5.53,51.47 v5.37,51.63
N$6
  Bottom 0.254: R5.1 21.89,1.55 OUT_2.P3
N$7
  Bottom 0.254: R6.1 8.38,1.66 OUT_1.P3
N$8
  Bottom 0.254: IC5.7 4.89,47.73 R42.1 R40.2
N$9  (via drill 0.4)
  Top 0.254: v10.9,69.91 10.9,74.1 8.4,76.6 v6.2,76.6 | v3.7,54 3.7,58.9 R3.P$3 6.2,61.4 7.8,61.4 8.7,62.3 8.7,66.7 v10.3,68.3 | R1.P$1 9.3,87.9 8.8,88.4 2.6,88.4 1.6,87.4 1.6,84.8 3.5,82.9 v5.2,82.9
  Bottom 0.254: R54.1 R3.P$3 | v10.3,68.3 10.9,68.9 v10.9,69.91 | IC5.9 R47.2 | R47.2 3.8,55.63 C22.2 | IC5.9 | IC5.9 5.53,52.9 3.95,51.32 3.95,48.75 2.6,47.4 2.6,44.1 3.1,43.6 5.2,43.6 5.45,43.85 R40.1 | R47.2 5.33,55.63 | R47.2 3.9,54 v3.7,54 | v5.2,82.9 5.2,77.6 v6.2,76.6
N$10  (via drill 0.4)
  Top 0.254: v5.4,6 4.38,7.02 v4.38,9.8 | v4.4,17.7 8.3,17.7 8.8,18.2 8.8,19.8 8.1,20.5 6.34,20.5 5.3,21.54 v5.3,28.9
  Bottom 0.254: C13.1 R9.2 | IC1.6 13.03,6.07 12.7,6.4 12,6.4 11.65,6.05 R9.2 | R9.2 R8.1 7.33,6 v5.4,6 | v4.38,9.8 4.38,17.68 v4.4,17.7 | R29.1 6.27,28.9 v5.3,28.9 4.28,29.92 R30.1
N$11  (via drill 0.6)
  Top 0.508: v6.26,78.76 6.86,78.16 D1.A
  Bottom 0.508: POWER!.9 7.02,78 v6.26,78.76
  Bottom 0.813: POWER!.9 POWER!.10
N$12  (via drill 0.6)
  Top 0.508: P1.2 20.13,84.43 v20.1,84.4
  Bottom 0.508: v20.1,84.4 18.78,83.08 POWER!.2
  Bottom 0.813: POWER!.2 POWER!.1
N$13
  Top 0.508: L1.2 P1.1
N$14
  Bottom 0.254: R55.1 R3.P$2
N$15
  Bottom 0.254: IC5.13 8.07,54.77 8.53,55.23 10.4,55.23 13.19,58.02 13.19,72.29 12.08,73.4 6.9,73.4 5.53,74.77 LED1.A 5.11,74.58 R59.1 3.43,74.9
N$16
  Top 0.508: D1.C 13.27,77.23 14.1,76.4 14.1,75.57 L2.2
N$17
  Bottom 0.254: R26.1 18.08,22.46 C15.1
N$18  (via drill 0.4)
  Top 0.254: LED3.K 3.4,37.33 3.4,29.12 4.28,28.23 4.28,21.12 4.6,20.8 v4.6,19.5 | v16.25,6.7 15.25,7.7 v5.9,7.7
  Bottom 0.254: v4.6,19.5 3.7,18.6 3.7,8.82 4.82,7.7 v5.9,7.7 | IC1.1 16.2,6.65 v16.25,6.7
N$19  (via drill 0.4)
  Top 0.254: LED3.A 5.2,42 2.89,39.69 2.89,28.91 3.78,28.02 3.78,20.25 v3.81,20.21
  Bottom 0.254: LED3.A 3.41,42 R38.1 | IC1.2 15.57,6.53 14.6,7.5 12.38,7.5 11.58,6.7 5.1,6.7 3.19,8.61 3.19,19.59 v3.81,20.21
N$20
  Bottom 0.254: R36.1 C18.1
N$21
  Bottom 0.254: R22.2 10.67,19.17 6.8,15.3 IN_1.P3
N$22
  Bottom 0.254: R14.1 R17.2 8.76,11.8 9.38,12.41 12.12,12.41 13.03,11.5 IC1.9
N$24
  Bottom 0.254: R26.2 17.4,24.88 R28.1 17.45,25.02 18.6,26.18 18.6,27.2 17.66,28.14 IC3.7
N$25
  Bottom 0.254: R14.2 7.92,8.15 OUT_1.P2
N$26  (via drill 0.4)
  Top 0.254: v14.24,12.97 18.33,12.97 v19.9,11.4 | v14.93,28.76 14.93,29.73 16,30.8 v18.8,30.8
  Bottom 0.254: IC2.2 15.57,13.57 R18.2 14.97,12.97 v14.24,12.97 | IC3.5 17.02,30.8 v18.8,30.8 | v14.93,28.76 14.26,28.09 14.26,25.51 13.54,24.79 13.54,23.56 14.9,22.2 17,22.2 18,21.2 18.6,21.2 19.54,20.26 19.54,18.09 20.51,17.12 20.51,12.59 19.9,11.98 v19.9,11.4
N$27  (via drill 0.4)
  Top 0.254: v17,40.6 17,36.9 v14.9,34.8 | v16.2,8 19.8,8 v20,8.2 | v19.4,10.4 17.9,11.9 13.8,11.9 v10.9,14.8 | v13.08,19.4 13.08,20.32 12.74,20.66 10.4,20.66 10.21,20.47 10.21,17.5 10.5,17.21 v10.5,16.7
  Bottom 0.254: R50.1 16.99,56.17 16.99,55 | 16.99,55 | 16.99,55 v16.99,40.61 v17,40.6 | IC2.9 13.03,21.4 | 13.03,21.4 13.03,25 13.75,25.72 13.75,28.33 13.96,28.54 13.96,29.42 14.17,29.63 14.17,34.07 v14.9,34.8 | C14.1 R11.1 R12.2 v20,8.2 20,8.9 19.4,9.5 v19.4,10.4 | R13.1 11.36,8.14 11.48,8.02 16.18,8.02 v16.2,8 | v10.9,14.8 10.5,15.2 v10.5,16.7 | v13.08,19.4 13.03,19.45 13.03,21.4
N$28
  Bottom 0.254: R52.2 23.98,64.32 26.8,61.5 26.8,45.7 25.2,44.1 25.2,34.96 25.76,34.4 25.76,30.11 25.52,29.88 24.47,28.83 24.47,28 24.03,27.55 CV_2.P3
N$29  (via drill 0.4)
  Top 0.254: R4.P$1 23.02,60.98 18.18,60.98 17.7,60.5 v17.7,53 | v17.7,48.8 20,46.5 v22,46.5
  Bottom 0.254: IC4.6 R41.2 20.81,46.5 v22,46.5 | v17.7,53 v17.7,48.8
N$30
  Bottom 0.254: IC4.7 20.09,47.66 R41.1 R39.2
N$31  (via drill 0.4)
  Top 0.254: R4.P$3 19.5,55.1 v18.9,54.5
  Bottom 0.254: R4.P$3 19.5,62.6 | 19.5,62.6 R53.1 | R39.1 19.31,43.4 18.4,43.4 17.9,43.9 17.9,47.6 20.73,50.43 IC4.9 20.73,54.8 19.91,55.62 | 19.91,55.62 C23.2 20.71,56.5 22.52,56.5 R48.2 | v18.9,54.5 19.91,55.52 19.91,55.62 | R2.P$1 25.12,87.25 26.27,86.1 26.27,74.42 24.95,73.1 21.1,73.1 20.3,72.3 20.3,65.3 20.8,64.8 20.8,63 20.4,62.6 19.5,62.6
N$32
  Bottom 0.305: R60.1 22,90.75 R2.P$2
N$33  (via drill 0.4)
  Top 0.254: v15.88,60.75 16.05,60.75 16.79,61.49 25.19,61.49 26.39,60.29 26.39,55.1 26.02,54.73 v26.02,54.6
  Bottom 0.254: v15.88,60.75 15.2,61.43 15.2,72.8 17.45,75.05 18.95,75.05 19.9,76 22.27,76 LED2.K | v26.02,54.6 26,54.6 25.1,53.7 25.08,53.72 IC4.14
N$34  (via drill 0.4)
  Top 0.254: v15.88,62 25.4,62 26.9,60.5 26.9,54.1 26.08,53.28 v26.02,53.28
  Bottom 0.254: v15.88,62 15.71,62.17 15.71,72.59 17.25,74.13 R58.1 19.8,75 LED2.A | v26.02,53.28 25.14,52.4 23.9,52.4 23.27,53.03 IC4.13
N$35  (via drill 0.4)
  Top 0.254: v11.8,17.2 12.5,17.9 17.12,17.9 18.01,17.01 26.31,17.01 v26.88,17.58 v26.87,17.59 | v25.43,28.35 24.13,29.65 v24.13,29.77
  Bottom 0.254: IC2.7 12.39,16.61 v11.8,17.2 | v25.43,28.35 27.46,26.32 27.46,18.18 v26.87,17.59 | v24.13,29.77 24.13,32.2 24.74,32.82 24.74,33.38 24.73,33.39 24.73,33.5 24.73,33.77 24.18,34.33 24.18,41 23.27,41.91 LED4.K
N$36  (via drill 0.4)
  Top 0.254: v26.9,16.5 21,16.5 17.8,16.5 17.1,17.2 v13,17.2 | v24.98,30.41 24.98,30.33 v26.12,29.19
  Bottom 0.254: v13,17.2 13,15.86 IC2.6 | v26.9,16.5 27.96,17.57 27.96,27.34 v26.12,29.19 | R37.1 20.61,41.88 LED4.A 20.7,42.03 20.7,42.8 21.4,43.5 23.4,43.5 24.69,42.21 24.69,34.66 25.25,34.1 25.25,32.61 24.98,32.33 v24.98,30.41
N$37  (via drill 0.4)
  Top 0.254: v22.38,17.7 18.04,17.7 16.42,19.32 16.02,19.72 15.9,19.84 v15.9,19.9
  Bottom 0.254: R15.1 26.55,10.9 | 26.55,10.9 26.55,11 R16.2 | 26.55,10.9 26.55,12.3 26.55,12.85 22.38,17.02 v22.38,17.7 | IC2.13 15.57,20.23 v15.9,19.9
N$38
  Bottom 0.254: R15.2 22.02,9.25 OUT_2.P2
N$39
  Bottom 0.254: IC2.1 17.05,14.99 R18.1 17.05,9.4 17.05,5.75 17.63,5.17 R11.2
N$40
  Bottom 0.254: R52.1 R4.P$2
N$41
  Bottom 0.254: R31.1 C17.1
N$42  (via drill 0.4)
  Top 0.254: v23.2,45.1 24.4,45.1 25.1,44.4 25.1,35.2 23.1,33.2 19.9,33.2 18.8,32.1 v18.8,32
  Bottom 0.254: R21.1 R23.1 21.77,20.33 20.5,21.6 20.5,28 20,28.5 20,31.2 19.2,32 v18.8,32 18.75,31.95 IC3.4 | v23.2,45.1 23.2,45.6 23.2,46.55 | 23.2,46.55 C21.1 | IC4.2 C21.1 | C21.1 23.2,46.55
N$43  (via drill 0.4)
  Top 0.254: v24.1,44.1 24.1,43.9 24.59,43.41 24.59,35.41 22.89,33.71 19.31,33.71 v18.8,33.2
  Bottom 0.254: IC4.1 24.38,48.28 24.4,48.3 24.97,47.73 C21.2 24.97,44.97 v24.1,44.1 | v18.8,33.2 18.77,33.23 IC3.3 15.62,33.23 15.12,32.72 15.12,29.88 15.6,29.4 16.89,29.4 IC3.6
N$44  (via drill 0.4)
  Top 0.254: IN_2.P3 22.22,14.78 24.94,14.78 25.68,15.52 v25.96,15.8
  Bottom 0.254: R21.2 25.85,15.8 v25.96,15.8
N$47
  Bottom 0.254: 10.72,48.38 R43.1 10.67,45.37 10.13,44.83 C19.1
N$54
  Bottom 0.254: R27.2 7.82,23.19 IN_1.P2
N$64  (via drill 0.4)
  Top 0.254: v5.23,18.67 5.3,18.74 5.3,20.82 4.79,21.33 4.79,28.44 4.37,28.87 4.37,31.57 6.02,33.22 v6.78,33.22
  Bottom 0.254: R29.2 R32.1 5.95,32.39 v6.78,33.22 | IC1.14 16.2,11.2 | 16.2,11.2 | v5.23,18.67 5.23,14.07 6.1,13.2 7.9,13.2 8.18,12.92 12.32,12.92 13.03,12.22 15.18,12.22 16.2,11.2
N$65  (via drill 0.4)
  Top 0.254: v8.8,28.7 8.8,26.6 v9.9,25.5
  Bottom 0.254: IC5.2 8.07,46.97 C20.1 7.15,46.55 6.7,46.1 6.7,41.5 8.19,40.01 8.19,33.99 9.34,32.84 9.41,32.77 9.54,32.64 | IC3.13 10.23,31.95 10.19,31.99 9.89,32.29 | 9.89,32.29 9.54,32.64 | R22.1 8.97,21.34 R24.1 9.9,22.27 v9.9,25.5 | 9.54,32.64 | 9.89,32.29 8.8,31.2 v8.8,28.7
N$66
  Bottom 0.254: IC5.1 9.35,47.64 C20.2 8.5,45.7 8.5,44 9.3,43.2 9.3,40.7 8.7,40.1 8.7,34.2 9.68,33.23 IC3.14 12.6,33.23 13.15,32.67 13.15,30.05 12.52,29.41 IC3.11
N$75
  Bottom 0.254: R43.2 10.82,50.13 R44.1 12.5,48.3 12.48,48.3 11.18,47 11.18,44.68 9.81,43.31 9.81,40.49 9.21,39.89 9.21,38 10.36,36.85 13.45,36.85 14.1,36.2 14.1,34.8 13.66,34.36 13.66,29.84 13.45,29.63 13.45,28.75 12.8,28.1 11.74,28.1 IC3.10
N$87
  Bottom 0.254: R25.2 IN_2.P2
N$96
  Bottom 0.254: R7.1 15.24,3.18 R10.1 14.94,3.38 IC1.3
N$97
  Bottom 0.254: R20.1 17.6,17.61 16.19,17.61 15.9,17.9 14.2,17.9 13.68,17.38 13.68,15.85 IC2.5 | R20.1 | R20.1 18.69,14.97 R19.1
N$99
  Bottom 0.254: 7.43,54.06 IC5.12 7.43,52.97 8,52.4 9.72,52.4 R46.1 R45.1
N$103
  Bottom 0.254: IC4.12 22.64,54.55 22.54,54.64 | 22.54,54.64 R49.1 | R51.1 24.06,54.64 22.54,54.64
OUT1
  Bottom 0.254: C13.2 R9.1 12.39,4.12 IC1.7 | R6.2 11.11,0.64 12.38,0.64 C13.2 | R7.2 C13.2
OUT2
  Bottom 0.254: R20.2 16.3,18.22 16.11,18.41 13.99,18.41 13.98,18.4 13,18.4 12.4,19 IC2.8 | R5.2 18.32,1.57 C14.2 19.2,4.06 19.2,6.13 18.32,7.01 | 18.32,7.01 R12.1 | 18.78,18.22 R20.2 | R20.2 20,16.91 20,12.8 18.7,11.5 18.7,7.4 18.32,7.01
VCC  (via drill 0.4)
  Top 0.254: C5.1 6.9,48.85 v6.9,49.8 | 22.19,48.8 C6.1 22.67,48.93 v22,49.6 | v14.3,6.7 14.66,6.34 C12.1 9.58,5.38 8.2,4 3.9,4 1.8,6.1 v1.8,16.2 2.17,15.83 C10.1 14.67,15.17 v13.9,14.4 | v22,49.6 21.8,49.8 | v6.9,49.8 3.67,49.8 v3.07,49.2 | v4.97,33.9 8.7,33.9 10.18,35.38 13.08,35.38 | 13.08,35.38 v13.4,35.7 | v22,49.6 21.8,49.8 | 21.8,49.8 v6.9,49.8 | v13.4,35.7 15.34,37.64 v15.34,40.78 | 13.08,35.38 v13.4,35.7 | v13.4,35.7 12.77,36.33 C7.1
  Top 0.305: C1.+ 1.8,75.68 v1.8,69.1 2.7,69.1 4.1,67.7 4.1,63.8 1.8,61.5 1.8,55.9 | 1.8,33.7 1.8,33.9 v1.65,33.9 | 1.8,33.7 1.8,22.5 1.8,19.4 | 1.8,55.9 | 1.8,19.4 | 1.8,19.4 v1.8,16.2 | 1.8,55.9 1.8,49.35 v1.65,49.2 1.65,48.7 1.8,48.55 1.8,48.2 1.8,34.78 1.65,34.63 1.65,33.85 1.8,33.7
  Top 0.508: L2.1 14.9,76.33 14.9,79.3 13.7,80.5 9.5,80.5 8.57,81.43 C1.+
  Bottom 0.254: v1.65,33.9 2.1,33.9 3,33.9 v4.97,33.9 | v1.65,49.2 v3.07,49.2 | IC5.4 6.8,49.7 v6.9,49.8 | IC4.4 v22,49.6 | IC1.4 v14.3,6.7 | v13.4,35.7 13.34,35.77 IC3.16 | v15.34,40.78 15.34,39.62 R35.1 | v13.9,14.4 14.3,14.8 IC2.4
  Bottom 0.305: C24.1 5.01,66.69 3.29,68.41 R56.1 3.26,69.1 v1.8,69.1
VEE  (via drill 0.4)
  Top 0.254: v7,52.3 7.03,52.33 C4.2 6.86,53.5 | v22,52.5 22.68,53.18 C3.2 19.7,53.7 17.3,51.3 8,51.3 v7,52.3 | v14.3,20.1 14.68,20.48 C9.2 10.17,21.17 9.7,20.7 9.7,17.38 8.82,16.5 3.59,16.5 v2.51,17.58 | 2.61,10.6 v2.51,10.7 2.61,10.6 | v7,52.3 5.6,50.9 2.36,50.9 | 2.61,10.6 14.58,10.6 C11.2 13.08,9.1 v13.08,8.7 | C8.2 10.35,27.2 v10.11,27.44
  Top 0.305: L1.1 23.65,76.95 26.6,74 v26.6,69.2 6.7,69.2 4.66,67.16 4.66,63.57 2.36,61.27 2.36,56 2.36,55.6 2.36,54.6 2.36,53.5 2.36,50.9 2.36,48.8 2.36,28.6 2.36,28.4 | 2.36,28.4 | 2.36,25.9 v2.51,25.9 | 2.36,28.4 2.36,25.9 | v2.51,17.58 2.36,17.73 2.36,25.9
  Top 0.508: C2.- 20.65,78.36 D2.A 22.8,78.14 23.03,77.91 L1.1
  Bottom 0.254: v7,52.3 6.8,52.5 IC5.11 | v22,52.5 IC4.11 | v14.3,20.1 IC2.11 | v2.51,17.58 v2.51,10.7 | IC1.11 14.3,9.1 13.9,8.7 v13.08,8.7 | v10.11,27.44 10.67,26.88 IC3.9
  Bottom 0.305: C25.1 24.08,67.28 25.19,68.39 R57.1 25.22,69.2 v26.6,69.2 | v2.51,25.9 2.71,26.1 7.9,26.1 9.24,27.44 v10.11,27.44

### Text on the board
bPlace: Dazzle | Based on BLINDS by / Olivier Gillet | v1.0 | CC-BY-SA 4.0 | www.plum-audio.com | OUT | IN | V2164 | Layout By: / Shay Shezifi (PLUM)